# EAGLE design PCB-RS232-DB9 (EAGLE 7.5.0)

## Sheet 1 of 2
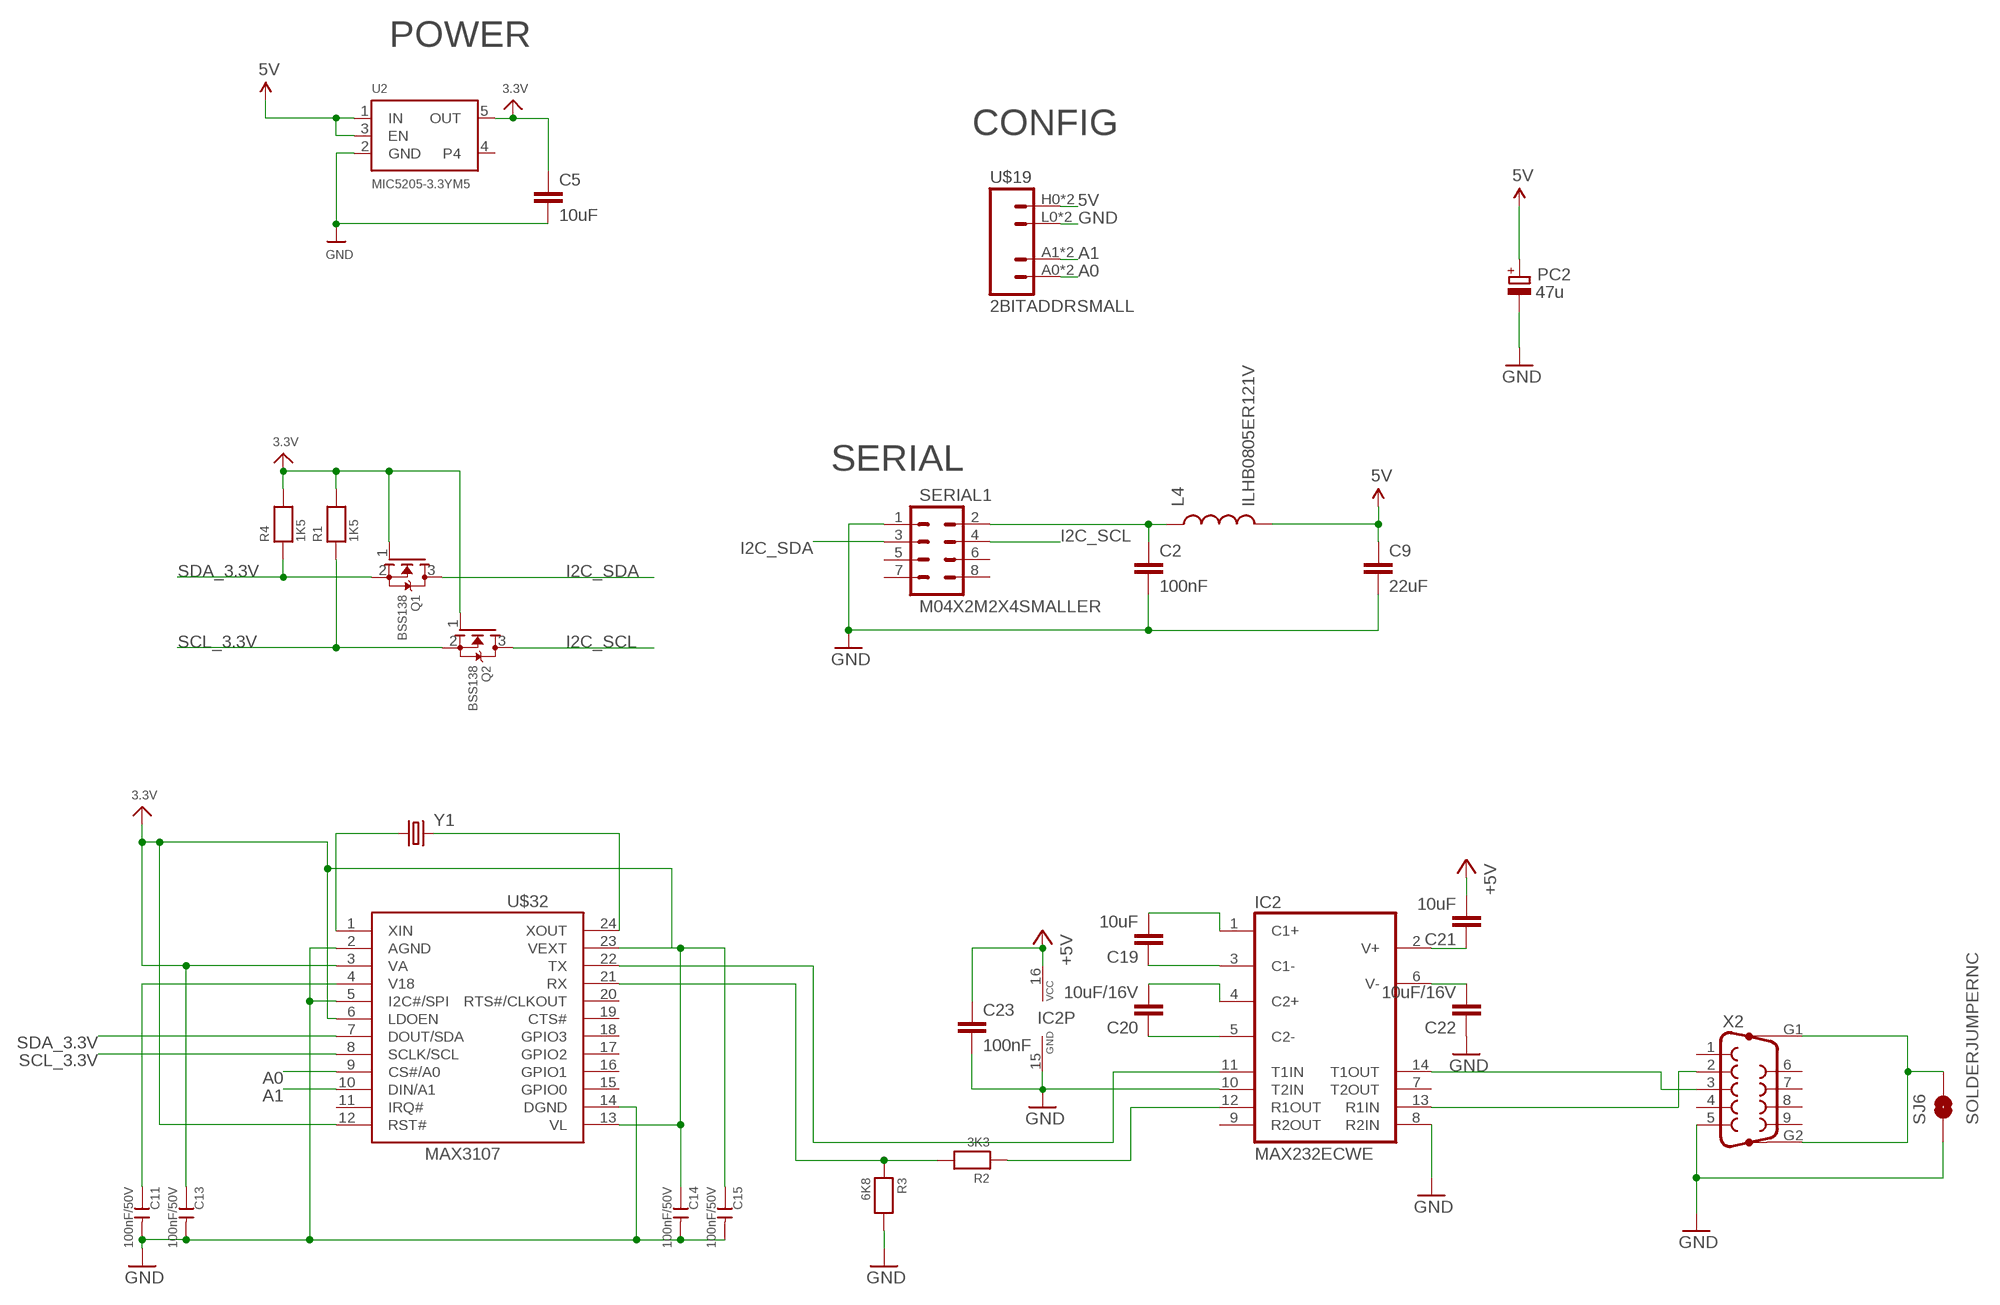
[diagram p0: schematic, sheet 1]

### Parts
C2  100nF  CAP0603-CAP  [0603-CAP]
C5  10uF  CAP0805  [0805]
C9  22uF  CAP0805  [0805]
C11  100nF/50V  CAP-0603  [C0603]
C13  100nF/50V  CAP-0603  [C0603]
C14  100nF/50V  CAP-0603  [C0603]
C15  100nF/50V  CAP-0603  [C0603]
C19  10uF  CAP0805  [0805]
C20  10uF/16V  CAP0805  [0805]
C21  10uF  CAP0805  [0805]
C22  10uF/16V  CAP0805  [0805]
C23  100nF  CAP0603-CAP  [0603-CAP]
IC2  MAX232ECWE  [SO16L]
L4  ILHB0805ER121V  INDUCTOR0805  [0805]
PC2  47u  CPOL-EUD  [PANASONIC_D]
Q1  BSS138  MOSFET-NREFLOW  [SOT23-R]
Q2  BSS138  MOSFET-NREFLOW  [SOT23-R]
R1  1K5  RESISTOR0603  [0603]
R2  3K3  RESISTOR0603  [0603]
R3  6K8  RESISTOR0603  [0603]
R4  1K5  RESISTOR0603  [0603]
SERIAL1  M04X2M2X4SMALLER  [M2X4SMALLER]
SJ6  SOLDERJUMPERNC  [SJ_2S]
U2  MIC5205-3.3YM5  VREG_SOT23-5  [SOT23-5]
U$19  2BITADDRSMALL  [2BITADDR_SMALL]
U$32  MAX3107  [SSOP24]
X2  F09HP  [F09HP]
Y1  CRYSTALHC49US  [HC49US]

### Nets
3.3V [Power]: C5.1 C13.1 C14.1 C15.1 Q1.1(G) Q2.1(G) R1.2 R4.2 U2.5(OUT) U$32.3(VA) U$32.6(LDOEN) U$32.12(RST#) U$32.13(VL) U$32.23(VEXT)
5V [Power]: C9.1 C21.2 C23.1 IC2.16(VCC) L4.2 PC2.+ U2.1(IN) U2.3(EN) U$19.H0(VCC) U$19.H1(VCC) ; supply symbol labelled +5V
A0: U$19.A0(A1) U$19.AS0(A1) U$32.9(CS#/A0)
A1: U$19.A1(A2) U$19.AS1(A2) U$32.10(DIN/A1)
GND [Power]: C2.2 C5.2 C9.2 C11.2 C13.2 C14.2 C15.2 C22.1 C23.2 IC2.8(R2IN) IC2.10(T2IN) IC2.15(GND) PC2.- R3.2 SERIAL1.1 SJ6.1 U2.2(GND) U$19.L0(GND) U$19.L1(GND) U$32.2(AGND) U$32.5(I2C#/SPI) U$32.14(DGND) X2.5
I2C_SCL: Q2.3(D) SERIAL1.4
I2C_SDA: Q1.3(D) SERIAL1.3
MAX232_V+ [Power]: C21.1 IC2.2(V+)
N$1: IC2.11(T1IN) U$32.22(TX)
N$2: R2.2 R3.1 U$32.21(RX)
N$3 [Power]: C2.1 L4.1 SERIAL1.2
N$4: C19.1 IC2.3(C1-)
N$5: C20.1 IC2.5(C2-)
N$6: C11.1 U$32.4(V18)
N$7: C20.2 IC2.4(C2+)
N$8: IC2.12(R1OUT) R2.1
N$9 [Power]: SJ6.2 X2.G1 X2.G2
N$11: U$32.1(XIN) Y1.1
N$12: IC2.13(R1IN) X2.2
N$17: IC2.14(T1OUT) X2.3
N$27: U$32.24(XOUT) Y1.2
N$47: C19.2 IC2.1(C1+)
N$49 [Power]: C22.2 IC2.6(V-)
SCL_3.3V: Q2.2(S) R1.1 U$32.8(SCLK/SCL)
SDA_3.3V: Q1.2(S) R4.1 U$32.7(DOUT/SDA)
Unconnected: IC2.7(T2OUT) IC2.9(R2OUT) SERIAL1.5 SERIAL1.6 SERIAL1.7 SERIAL1.8 U2.4 U$32.11(IRQ#) U$32.15(GPIO0) U$32.16(GPIO1) U$32.17(GPIO2) U$32.18(GPIO3) U$32.19(CTS#) U$32.20(RTS#/CLKOUT) X2.1 X2.4 X2.6 X2.7 X2.8 X2.9

### Notes on the sheet
- POWER
- CONFIG
- SERIAL

## Sheet 2 of 2

## Library data of the parts
C2 C5 C9 C19-C23 = SparkFun:CAP: Capacitor Standard 0603 ceramic capacitor, and 0.1" leaded capacitor.
C11 C13-C15 = OPL:CAP: Ceramic Capacitors
IC2 = maxim:MAX232ECWE: RS232 TRANSCEIVER; MF: MAXIM; MPN: MAX232ECWE+; OC_FARNELL: 9724435; OC_NEWARK: 67K4440
L4 = SparkFun:INDUCTOR: Inductors Basic Inductor/Choke - 0603 and 1206. Footprints are not proven and vary greatly between part numbers.
PC2 = rcl:CPOL-EU: POLARIZED CAPACITOR, European symbol
Q1 Q2 = microbuilder:MOSFET-N: N-Channel Mosfet LEGEND VDS: Voltage Drain-Source ID: Drain Current RDS(ON): Drain-Source On-State Resistance VGS(TH): Gate-Source Threshold Voltage CISS: Drain-Source Input Capacitance SOT-23 Name VDS ID RDS(ON) VGS(TH) CISS Order Number 2N7002E 60V 260mA 2.5 Ohm 2.5V @ 250uA 26.7pF @ 25V 2N7002ET1GOSTR-ND BSH103 30V 850mA 400 mOhm 400mV @ 1mA 83pF @ 24V BSH103,235-ND BSS138 60V 320mA 1.6 Ohm 1.5V @ 250uA 50pF @ 10V Mouser: 771-BSS138PW115 DMN2075U-7 20V 4.2A 38 mOhm 1V @ 250 uA 594.3pF @ 10V DMN2075U-7DICT-ND * BSS138 good choice for I2C level-shifting
R1-R4 = microbuilder:RESISTOR: Resistors 0402 - 0402 Surface Mount Package 22 Ohm 1% 1/16W [Digikey: 311-22.0LRTR-ND] 33 Ohm 5% 1/16W 1.0K 5% 1/16W 1.5K 5% 1/16W 2.0K 1% 1/16W 10.0K 1% 1/16W [Digikey: 311-10.0KLRTR-ND] 10.0K 5% 1/16W [Digikey: RMCF0402JT10K0TR-ND] 12.1K 1% 1/16W [Digikey: 311-22.0LRTR-ND] 100.0K 5% 1/16W 0603 - 0603 Surface Mount Package 0 Ohm 1/10 Watt 1% Resistor 15 Ohm 1/10 Watt 1% Resistor 33 Ohm 1/10 Watt 1% Resistor 49.9 Ohm 1/10 Watt 1% Resistor 100 Ohm 1/10 Watt 1% Resistor 150 Ohm 1/10 Watt 1% Resistor 240 Ohm 1/10 Watt 1% Resistor 390 Ohm 1/10 Watt 1% Resistor 560 Ohm 1/10 Watt 1% Resistor 680 Ohm 1/10 Watt 1% Resistor 750 Ohm 1/10 Watt 1% Resistor 1.0K Ohm 1/10 Watt 1% Resistor 1.5K Ohm 1/10 Watt 1% Resistor 2.0K Ohm 1/10 Watt 1% Resistor 2.2K Ohm 1/10 Watt 1% Resistor 3.3K Ohm 1/10 Watt 1% Resistor 4.7K Ohm 1/10 Watt 1% Resistor 10.0K Ohm 1/10 Watt 1% Resistor 12.0K Ohm 1/10 Watt 1% Resistor 12.1K Ohm 1/10 Watt 1% Resistor 20.0K Ohm 1/10 Watt 1% Resistor 33.0K Ohm 1/10 Watt 1% Resistor 100.0K Ohm 1/10 Watt 1% Resistor 0805 - 0805 Surface Mount Package 0 Ohm 1/8 Watt 1% Resistor 33 Ohm 1/8 Watt 1% Resistor 100 Ohm 1/8 Watt 1% Resistor 150 Ohm 1/8 Watt 1% Resistor 200 Ohm 1/8 Watt 1% Resistor 240 Ohm 1/8 Watt 1% Resistor 330 Ohm 1/8 Watt 1% Resistor 390 Ohm 1/8 Watt 1% Resistor 470 Ohm 1/8 Watt 1% Resistor 1.0K Ohm 1/8 Watt 1% Resistor 1.5K Ohm 1/8 Watt 1% Resistor 2.0K Ohm 1/8 Watt 1% Resistor 4.7K Ohm 1/8 Watt 1% Resistor 5.1K Ohm 1/8 Watt 1% Resistor 5.6K Ohm 1/8 Watt 1% Resistor 10.0K Ohm 1/8 Watt 1% Resistor 22.0K Ohm 1/8 Watt 1% Resistor 33.0K Ohm 1/8 Watt 1% Resistor 100K Ohm 1/8 Watt 1% Resistor 1206 - 1206 Surface Mount Package 2012 - 2010 Surface Mount Package 0.11 Ohm 1/2 Watt 1% Resistor - Digikey: RHM.11UCT-ND
SERIAL1 = SKAARHOJ:M04X2
SJ6 = SparkFun:SOLDERJUMPER: Solder Jumper Standard SMD solder jumper. Used to automate production. Two varients : Normally Open and Normally Closed are the same, but have different paste layers. NC will have a large amount of paste and should jumper during reflow.
U2 = microbuilder:VREG_SOT23-5: SOT23-5 Fixed Voltage Regulators To better organise some of the SOT23-5 fixed voltage regulators in this library, this new part was created. Part Current Out V Out V In V Dropout Digikey Part No. ADP121 150mA 3.3V 3.4-5.5V 0.09V @ 150mA ADP121-AUJZ33R7CT-ND ADP121 150mA 3.0V 3.1-5.5V 0.09V @ 150mA ADP121-AUJZ30R7CT-ND ADP122 300mA 3.3V 3.4-5.5V 0.085V @ 300mA ADP122AUJZ-3.3-R7CT-ND ADP1712 300mA 3.3V 3.5-5.5V 0.17V @ 300mA ADP1712AUJZ-3.3-R7TR-ND AP7311 (Low Cost) 150mA 3.3V 3.5-6V 0.15V @ 150mA AP7311-33WG-7DICT-ND LD39015M18R 150mA 1.8V 1.9V-5.5V 0.08V @ 100mA 497-6977-1-ND MCP1824T-3302E/OT 300mA 3.3V 3.5V-6V 0.2V @ 300mA MCP1824T-3302E/OTCT-ND MIC5205-2.5YM5 TR 150mA 2.5V 2.7-16V 0.165V @ 150mA 576-1257-2-ND MIC5205-3.0YM5 TR 150mA 3.0V 3.2V-16V 0.165V @ 150mA 576-1258-2-ND MIC5205-3.3YM5 TR 150mA 3.3V 3.5V-16V 0.165V @ 150mA 576-1259-2-ND TPS780330220 150mA 3.3V+2.2V 3.6-5.5V 250mV Max 296-23332-1-ND TDA3663/N1,135 100mA 3.3V 3.5-45V 0.18V @ 50mA 568-5343-1-ND
U$19 = SKAARHOJ:2BITADDR
U$32 = SKAARHOJ:MAX3107
X2 = con-subd:F09HP: SUB-D; OC_FARNELL: unknown; OC_NEWARK: unknown
Y1 = SparkFun:CRYSTAL: Crystals Various standard crystals. Proven footprints. Spark Fun Electronics SKU : COM-00534

## Net classes
0 default: width 0.203 mm, drill 0.406 mm, clearance 0.203 mm
1 Power: width 0.406 mm, drill 0.61 mm, clearance 0.203 mm
2 RELAY LINES: width 0.305 mm, drill 0.406 mm, clearance 0.254 mm
3 INput lines: width 0.203 mm, drill 0.406 mm, clearance 0.254 mm

## Board
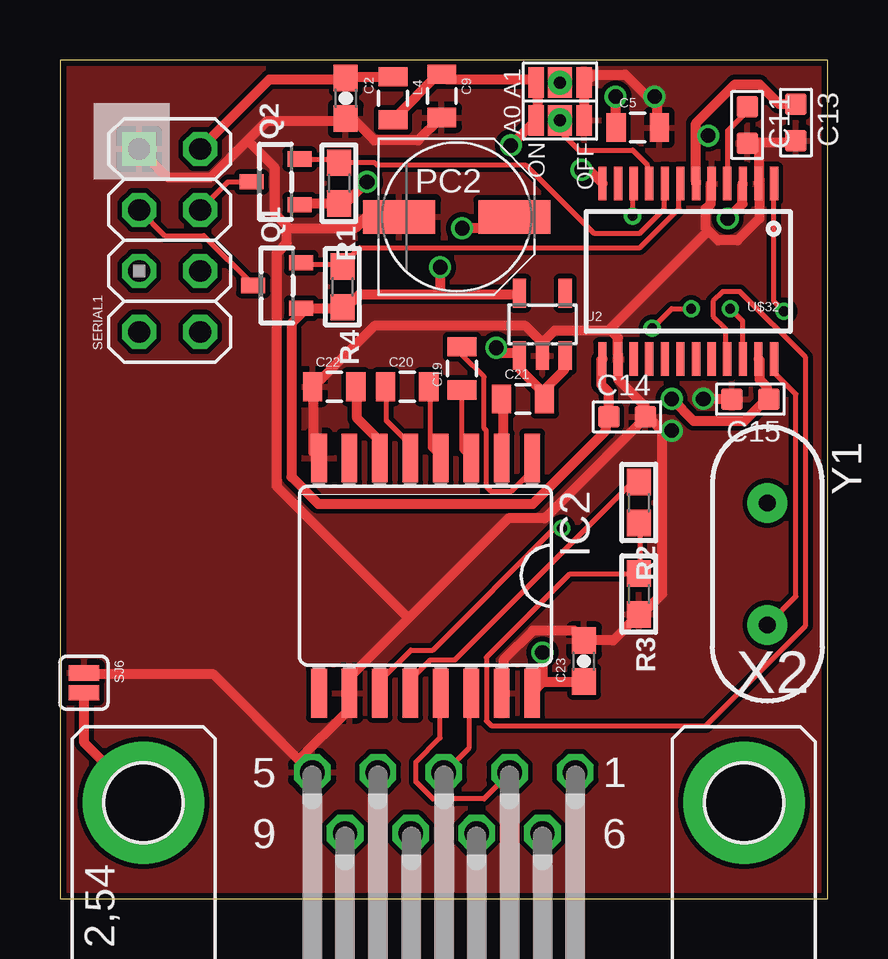
[diagram p1: board, top side]
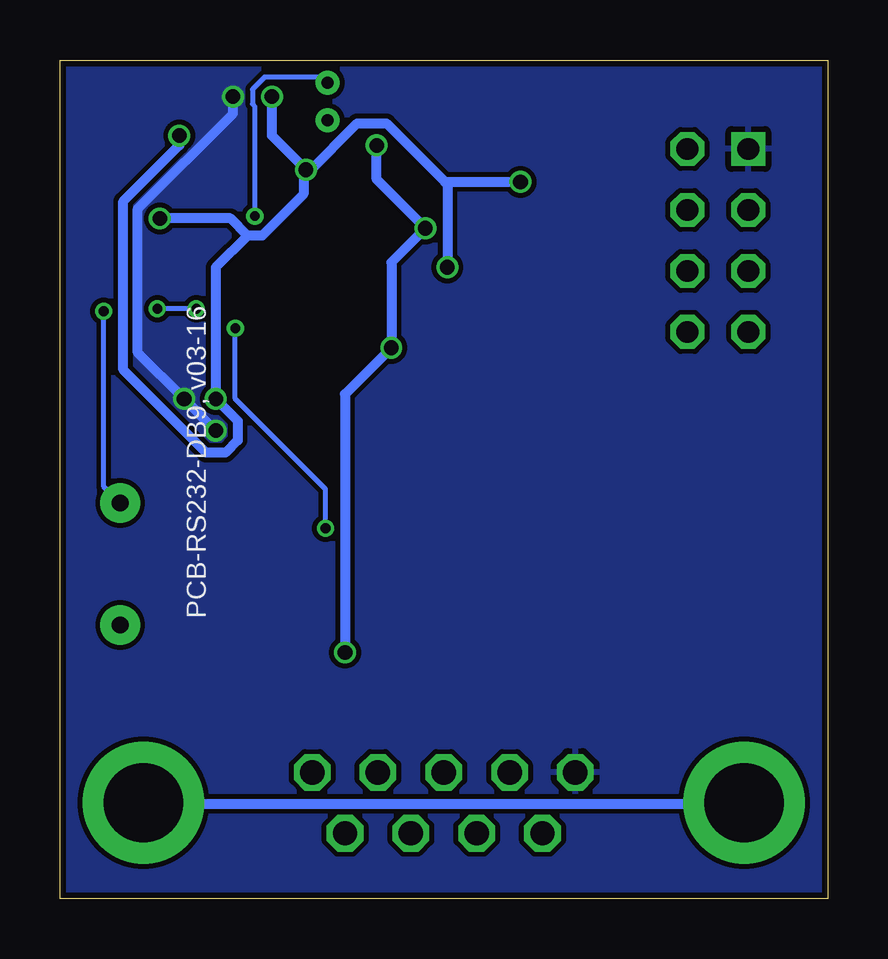
[diagram p2: board, bottom side, seen from below]

Size 32 x 34.95 mm. Coordinates in mm from the lower left corner, seen from the top.
Outline: 32,0 32,34.95 0,34.95 0,0 32,0
Copper layers (1*16): Top 0.035mm / dielectric 1.5mm / Bottom 0.035mm
Design rules "Fusion_eagle_rule_v1.1": minimum track width 6mil, minimum drill 12mil, track to track 6mil, track to pad 6mil, pad to pad 6mil, via to via 6mil, smd to smd 0mil, copper to edge 10mil, drill to drill 10mil, minimum pad ring 10mil, minimum via ring 6mil, stop-mask expansion 2mil, vias tented up to drill 100mil, thermal gap 10mil

### Footprints (pad centres in the part's own frame; a part is rotated, then mirrored left to right if it is on the bottom)
0603-CAP = smd 1.1 x 1: 1 -0.85,0; 2 0.85,0
0805 = smd 0.8 x 1.2: 1 -0.9,0; 2 0.9,0
C0603 = smd 0.889 x 0.889: 1 -0.762,0; 2 0.762,0
SO16L = smd 0.66 x 2.032: 1 -4.445,-4.902; 2 -3.175,-4.902; 3 -1.905,-4.902; 4 -0.635,-4.902; 5 0.635,-4.902; 6 1.905,-4.902; 7 3.175,-4.902; 8 4.445,-4.902; 9 4.445,4.902; 10 3.175,4.902; 11 1.905,4.902; 12 0.635,4.902; 13 -0.635,4.902; 14 -1.905,4.902; 15 -3.175,4.902; 16 -4.445,4.902
PANASONIC_D = smd 3 x 1.4: + 2.4,0; - -2.4,0
SOT23-R = smd 0.635 x 1.016: 1 -0.95,-1; 2 0.95,-1; 3 0,1
0603 = smd 1.1 x 1: 1 -0.85,0; 2 0.85,0
M2X4SMALLER = drill 0.9 square: 1 -1.27,3.81 | drill 0.9 octagon: 2 1.27,3.81; 3 -1.27,1.27; 4 1.27,1.27; 5 -1.27,-1.27; 6 1.27,-1.27; 7 -1.27,-3.81; 8 1.27,-3.81
SJ_2S = smd 0.635 x 1.27: 1 -0.412,0; 2 0.412,0
SOT23-5 = smd 0.55 x 1.2: 1 -0.95,-1.3; 2 0,-1.3; 3 0.95,-1.3; 4 0.95,1.3; 5 -0.95,1.3
2BITADDR_SMALL = drill 0.5: A0 -1.565,0; A1 0,0 | smd 1.27 x 1: AS0 -1.565,0; AS1 0,0 | smd 1.27 x 0.635: H0 -1.565,1; H1 0,1; L0 -1.565,-1; L1 0,-1
SSOP24 = smd 0.348 x 1.397: 1 -3.575,-3.656; 2 -2.925,-3.656; 3 -2.275,-3.656; 4 -1.625,-3.656; 5 -0.975,-3.656; 6 -0.325,-3.656; 7 0.325,-3.656; 8 0.975,-3.656; 9 1.625,-3.656; 10 2.275,-3.656; 11 2.925,-3.656; 12 3.575,-3.656; 13 3.575,3.656; 14 2.925,3.656; 15 2.275,3.656; 16 1.625,3.656; 17 0.975,3.656; 18 0.325,3.656; 19 -0.325,3.656; 20 -0.975,3.656; 21 -1.625,3.656; 22 -2.275,3.656; 23 -2.925,3.656; 24 -3.575,3.656
F09HP = drill 1.016 octagon: 1 -5.486,-1.27; 2 -2.743,-1.27; 3 0,-1.27; 4 2.743,-1.27; 5 5.486,-1.27; 6 -4.115,1.27; 7 -1.372,1.27; 8 1.372,1.27; 9 4.115,1.27 | drill 3.302 pad 5.08: G1 -12.522,0; G2 12.522,0
HC49US = drill 0.7 pad 1.651: 1 -2.54,0; 2 2.54,0

### Placement (x,y rotation side)
C2  11.92,33.36 270 top
C5  24.08,32.14 0 top
C9  15.92,33.45 270 top
C11  28.65,32.24 270 top
C13  30.68,32.34 270 top
C14  23.64,20.08 0 top
C15  28.78,20.82 180 top
C19  16.76,22.1 90 top
C20  14.48,21.34 0 top
C21  19.3,20.83 0 top
C22  11.43,21.34 0 top
C23  21.84,9.91 90 top
IC2  15.24,13.46 180 top
L4  13.88,33.36 270 top
PC2  16.54,28.41 0 top
Q1  9.05,25.55 90 top
Q2  8.99,29.87 90 top
R1  11.63,29.82 270 top
R2  24.13,16.51 270 top
R3  24.13,12.7 270 top
R4  11.78,25.5 270 top
SERIAL1  4.57,27.43 0 top
SJ6  1,9 270 top
U2  20.11,23.93 0 top
U$19  20.85,34 90 top
U$32  26.19,26.14 180 top
X2  16,4 180 top
Y1  29.49,13.95 270 top

### Tracks (layer width: path | path; a pad name or v marks a point on that pad's centre or on a via)
3.3V  (via drill 0.61)
  Top 0.406: U$32.13 22.55,22.45 22.55,21.44 22.86,21.13 22.86,20.12 C14.1 22.76,19.91 22.76,19.51 19.71,16.46 10.77,16.46 9.65,17.58 9.65,23.98 10.06,24.38 Q1.1 10.06,24.59 11.68,24.59 R4.2 11.99,24.69 12.5,25.2 15.85,25.2 | 15.85,25.2 19.1,25.2 U2.5 | 26.52,31.8 26.52,29.87 U$32.6 | 26.52,31.8 26.52,32.31 28.14,33.93 29.16,33.93 29.97,33.12 30.58,33.12 C13.1 | U$32.23 29.16,22.45 29.16,21.64 29.46,21.34 29.46,20.83 C15.1 29.36,20.73 28.55,19.91 26.42,19.91 v25.5,20.83 | Q2.1 10.06,28.96 11.58,28.96 R1.2 11.79,29.06 11.99,29.06 v12.8,29.87 | v23.16,33.43 23.16,32.21 C5.1 | v21.74,30.38 22.05,30.38 22.55,29.87 U$32.12 | v27.84,28.35 28.45,28.96 28.45,29.77 U$32.3 | v27.03,31.8 26.52,31.8 | v15.85,26.31 15.85,25.2
  Bottom 0.406: v23.16,33.43 23.16,31.8 v21.74,30.38 | v27.84,28.35 24.89,28.35 24.18,27.64 | 24.18,27.64 23.57,27.64 21.84,29.36 21.84,30.28 v21.74,30.38 | 15.85,29.87 15.95,29.87 18.39,32.31 19.61,32.31 21.64,30.28 v21.74,30.38 | 15.85,29.87 v12.8,29.87 | 24.18,27.64 25.5,26.31 v25.5,20.83 24.59,19.91 24.59,19.1 25.09,18.59 25.91,18.59 29.36,22.05 29.36,29.06 27.03,31.39 v27.03,31.8 | 15.85,29.87 v15.85,26.31
5V  (via drill 0.61)
  Top 0.406: L4.2 13.92,32.51 15.85,34.44 C9.1 16.05,34.24 16.15,34.14 19.71,34.14 U$19.H1 19.91,33.93 19.91,32.51 U$19.H0 19.71,32.31 v18.8,31.39 | 20.12,9.04 21.84,9.04 C23.1 | 20.12,9.04 19.71,8.64 IC2.16 | U2.3 21.03,22.55 21.03,22.05 20.22,21.23 20.22,20.83 C21.2 20.12,21.13 19.2,22.05 19.2,22.55 U2.1 19,22.76 18.39,22.76 v18.19,22.96 | v16.76,27.94 18.49,27.94 18.9,28.35 PC2.+ | v20.12,10.26 20.12,9.04
  Bottom 0.406: v20.12,10.26 20.12,21.03 v18.19,22.96 18.19,26.52 v16.76,27.94 18.8,29.97 v18.8,31.39
A0
  Top 0.203: 20.93,32.51 U$19.AS0 20.93,32.41 20.93,31.9 21.64,31.19 23.88,31.19 24.49,30.58 24.49,29.87 U$32.9
A1  (via drill 0.41)
  Top 0.203: 20.93,34.04 U$19.AS1 | v23.88,28.45 23.88,29.77 U$32.10
  Bottom 0.203: v23.88,28.45 23.88,33.02 23.98,33.12 23.98,33.73 23.47,34.24 21.13,34.24 20.93,34.04 U$19.AS1
GND  (via drill 0.61)
  Top 0.406: C9.2 15.85,32.51 14.94,31.6 13.11,31.6 12.29,32.41 11.99,32.41 C2.2 11.79,32.41 8.64,32.41 7.82,31.6 | 7.82,31.6 6.3,30.07 4.47,30.07 SERIAL1.1 | 9.55,27.94 12.29,27.94 12.7,28.35 14.12,28.35 PC2.- | 9.55,27.94 8.94,28.55 8.94,30.48 7.82,31.6 | 9.96,5.79 10.46,5.28 X2.5 | 9.96,5.79 6.4,9.35 1.02,9.35 SJ6.1 | 9.96,5.79 11.99,7.82 11.99,8.53 IC2.10 12.09,8.74 12.09,9.25 14.53,11.68 | IC2.15 18.49,8.64 18.49,9.96 19.71,11.18 21.44,11.18 21.74,10.87 C23.2 23.06,10.77 24.08,11.79 R3.2 24.28,11.89 25.09,12.7 25.09,19.41 v25.5,19.51 25.09,19.51 24.59,20.02 C14.2 | 29.16,31.5 30.58,31.5 C13.2 | 29.16,31.5 28.65,31.5 C11.2 | 27.03,27.84 27.43,27.43 28.25,27.43 29.16,28.35 29.16,29.77 U$32.2 29.16,29.97 29.16,31.5 | 27.03,27.84 26.92,27.94 26.92,28.75 27.13,28.96 27.13,29.77 U$32.5 | 24.59,33.33 23.57,34.34 22.25,34.34 21.95,34.04 U$19.L1 21.84,33.83 21.84,32.51 U$19.L0 | 24.59,33.33 24.89,33.02 24.89,32.21 C5.2 | IC2.8 10.57,18.59 10.57,21.34 C22.1 10.67,21.44 13.11,23.88 19.41,23.88 20.12,23.16 | C14.2 24.38,20.12 24.38,20.52 23.27,21.64 23.27,22.45 U$32.14 23.27,22.66 23.27,23.37 22.96,23.67 | v26.82,20.83 27.94,20.83 C15.2 | 20.12,23.16 20.12,22.66 U2.2 | 20.12,23.16 20.62,23.67 22.96,23.67 | v24.79,33.43 24.69,33.43 24.59,33.33 | 27.03,27.84 22.96,23.77 22.96,23.67 | 14.53,11.68 18.69,15.85 20.22,15.85 24.28,19.91 C14.2 | 14.53,11.68 9.04,17.17 9.04,26.92 9.45,27.33 9.45,27.84 9.55,27.94
  Bottom 0.406: v25.5,19.51 v26.82,20.83 28.75,22.76 28.75,28.75 24.79,32.72 v24.79,33.43
  pour Top: 0,0 31.75,0 31.75,35.56 0,35.56
  pour Bottom: 0,0 31.75,0 31.75,35.56 0,35.56
I2C_SCL
  Top 0.203: SERIAL1.4 7.01,29.87 7.92,29.87 Q2.3
I2C_SDA
  Top 0.203: SERIAL1.3 4.37,27.64 5.99,27.64 8.03,25.6 Q1.3
MAX232_V+
  Top 0.406: C21.1 18.49,20.83 18.49,18.39 IC2.2
N$1  (via drill 0.41)
  Top 0.203: v27.94,24.59 28.45,24.08 28.45,22.55 U$32.22 | v26.31,24.59 25.5,24.59 v24.69,23.77 | v20.93,15.44 20.62,15.44 15.54,10.36 14.63,10.36 13.41,9.14 13.41,8.64 IC2.11
  Bottom 0.203: v26.31,24.59 v27.94,24.59 | v24.69,23.77 24.69,20.83 20.93,17.07 v20.93,15.44
N$2
  Top 0.203: R2.2 24.18,15.65 24.18,13.61 R3.1 24.08,13.51 21.23,13.51 17.78,10.06 17.78,7.42 17.98,7.21 26.92,7.21 31.09,11.38 31.09,22.55 28.35,25.3 27.64,25.3 27.23,24.89 27.23,24.28 27.74,23.77 27.74,22.55 U$32.21
N$3
  Top 0.406: L4.1 13.82,34.24 11.99,34.24 C2.1 11.79,34.14 8.74,34.14 SERIAL1.2
N$4
  Top 0.203: C19.1 16.76,18.69 17.07,18.39 IC2.3
N$5
  Top 0.203: C20.1 13.61,21.34 13.61,19.91 14.53,19 14.53,18.39 IC2.5
N$6
  Top 0.203: C11.1 28.55,32.92 28.55,32.72 27.84,32 27.84,29.87 U$32.4
N$7
  Top 0.203: IC2.4 15.44,18.8 15.44,21.34 C20.2
N$8
  Top 0.203: R2.1 24.08,17.27 23.77,17.27 16.46,9.96 15.44,9.96 14.63,9.14 14.63,8.64 IC2.12
N$9
  Top 0.406: SJ6.2 1.02,8.53 1.02,6.5 3.45,4.06 X2.G2
  Bottom 0.406: X2.G2 3.56,3.96 28.45,3.96 X2.G1
N$11  (via drill 0.41)
  Top 0.203: v30.18,24.49 29.77,24.89 29.77,29.77 U$32.1
  Bottom 0.203: v30.18,24.49 30.18,17.17 29.57,16.56 Y1.1
N$12
  Top 0.203: IC2.13 15.85,8.53 15.85,6.71 14.83,5.69 14.83,4.88 15.54,4.17 17.68,4.17 18.69,5.18 X2.2
N$17
  Top 0.203: IC2.14 17.07,8.53 17.07,6.3 16.05,5.28 X2.3
N$27
  Top 0.203: U$32.24 29.77,22.45 29.77,21.95 30.68,21.03 30.68,12.6 29.57,11.48 Y1.2
N$47
  Top 0.203: C19.2 16.76,22.66 17.68,21.74 17.68,19.61 17.78,19.51 17.78,17.17 17.98,16.97 18.8,16.97 19.61,17.78 19.61,18.29 IC2.1
N$49
  Top 0.406: C22.2 12.39,21.34 12.39,20.02 13.31,19.1 13.31,18.39 IC2.6
SCL_3.3V
  Top 0.203: Q2.2 10.06,30.79 11.48,30.79 11.58,30.68 R1.1 11.68,30.68 13.11,30.68 13.21,30.58 19.41,30.58 22.25,27.74 24.18,27.74 25.2,28.75 25.2,29.77 U$32.8
SDA_3.3V
  Top 0.203: Q1.2 10.06,26.42 11.68,26.42 R4.1 11.79,26.42 12.5,27.13 24.18,27.13 25.81,28.75 25.81,29.77 U$32.7

### Text on the board
_bsilk: PCB-RS232-DB9, v03-16